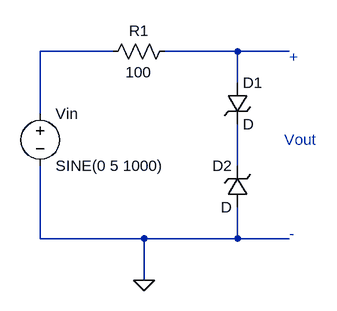
[diagram p0: schematic ClipperCircuit.asc]
ClipperCircuit.asc, the LTspice schematic file:
Version 4
SHEET 1 880 680
WIRE 384 208 272 208
WIRE 576 208 464 208
WIRE 656 208 576 208
WIRE 576 256 576 208
WIRE 272 304 272 208
WIRE 576 384 576 320
WIRE 272 496 272 384
WIRE 432 496 272 496
WIRE 576 496 576 448
WIRE 576 496 432 496
WIRE 656 496 576 496
WIRE 432 560 432 496
FLAG 432 560 0
SYMBOL voltage 272 288 R0
SYMATTR InstName Vin
SYMATTR Value SINE(0 5 1000)
SYMBOL res 480 192 R90
WINDOW 0 0 56 VBottom 2
WINDOW 3 32 56 VTop 2
SYMATTR InstName R1
SYMATTR Value 100
SYMBOL zener 560 256 R0
SYMATTR InstName D1
SYMBOL zener 592 448 R180
WINDOW 0 24 64 Left 2
WINDOW 3 24 0 Left 2
SYMATTR InstName D2
TEXT 656 216 Left 2 ;+
TEXT 656 488 Left 2 ;-
TEXT 648 344 Left 2 ;Vout

The netlist it stands for:
* ClipperCircuit.asc
Vin N001 0 SINE(0 5 1000)
R1 N002 N001 100
D1 N002 N003 D
D2 0 N003 D
.model D D
.lib standard.dio
* +
* -
* Vout
.backanno
.end